# EAGLE design Hirose64-OE-Millmax-Plating (EAGLE 9.6.2)
DESIGNER: JON NEWMAN, JAKOB VOIGTS; DESIGN_NAME: HEADSTAGE-64; LICENSE: CERN OHL v1.2; REVISION: 1.2
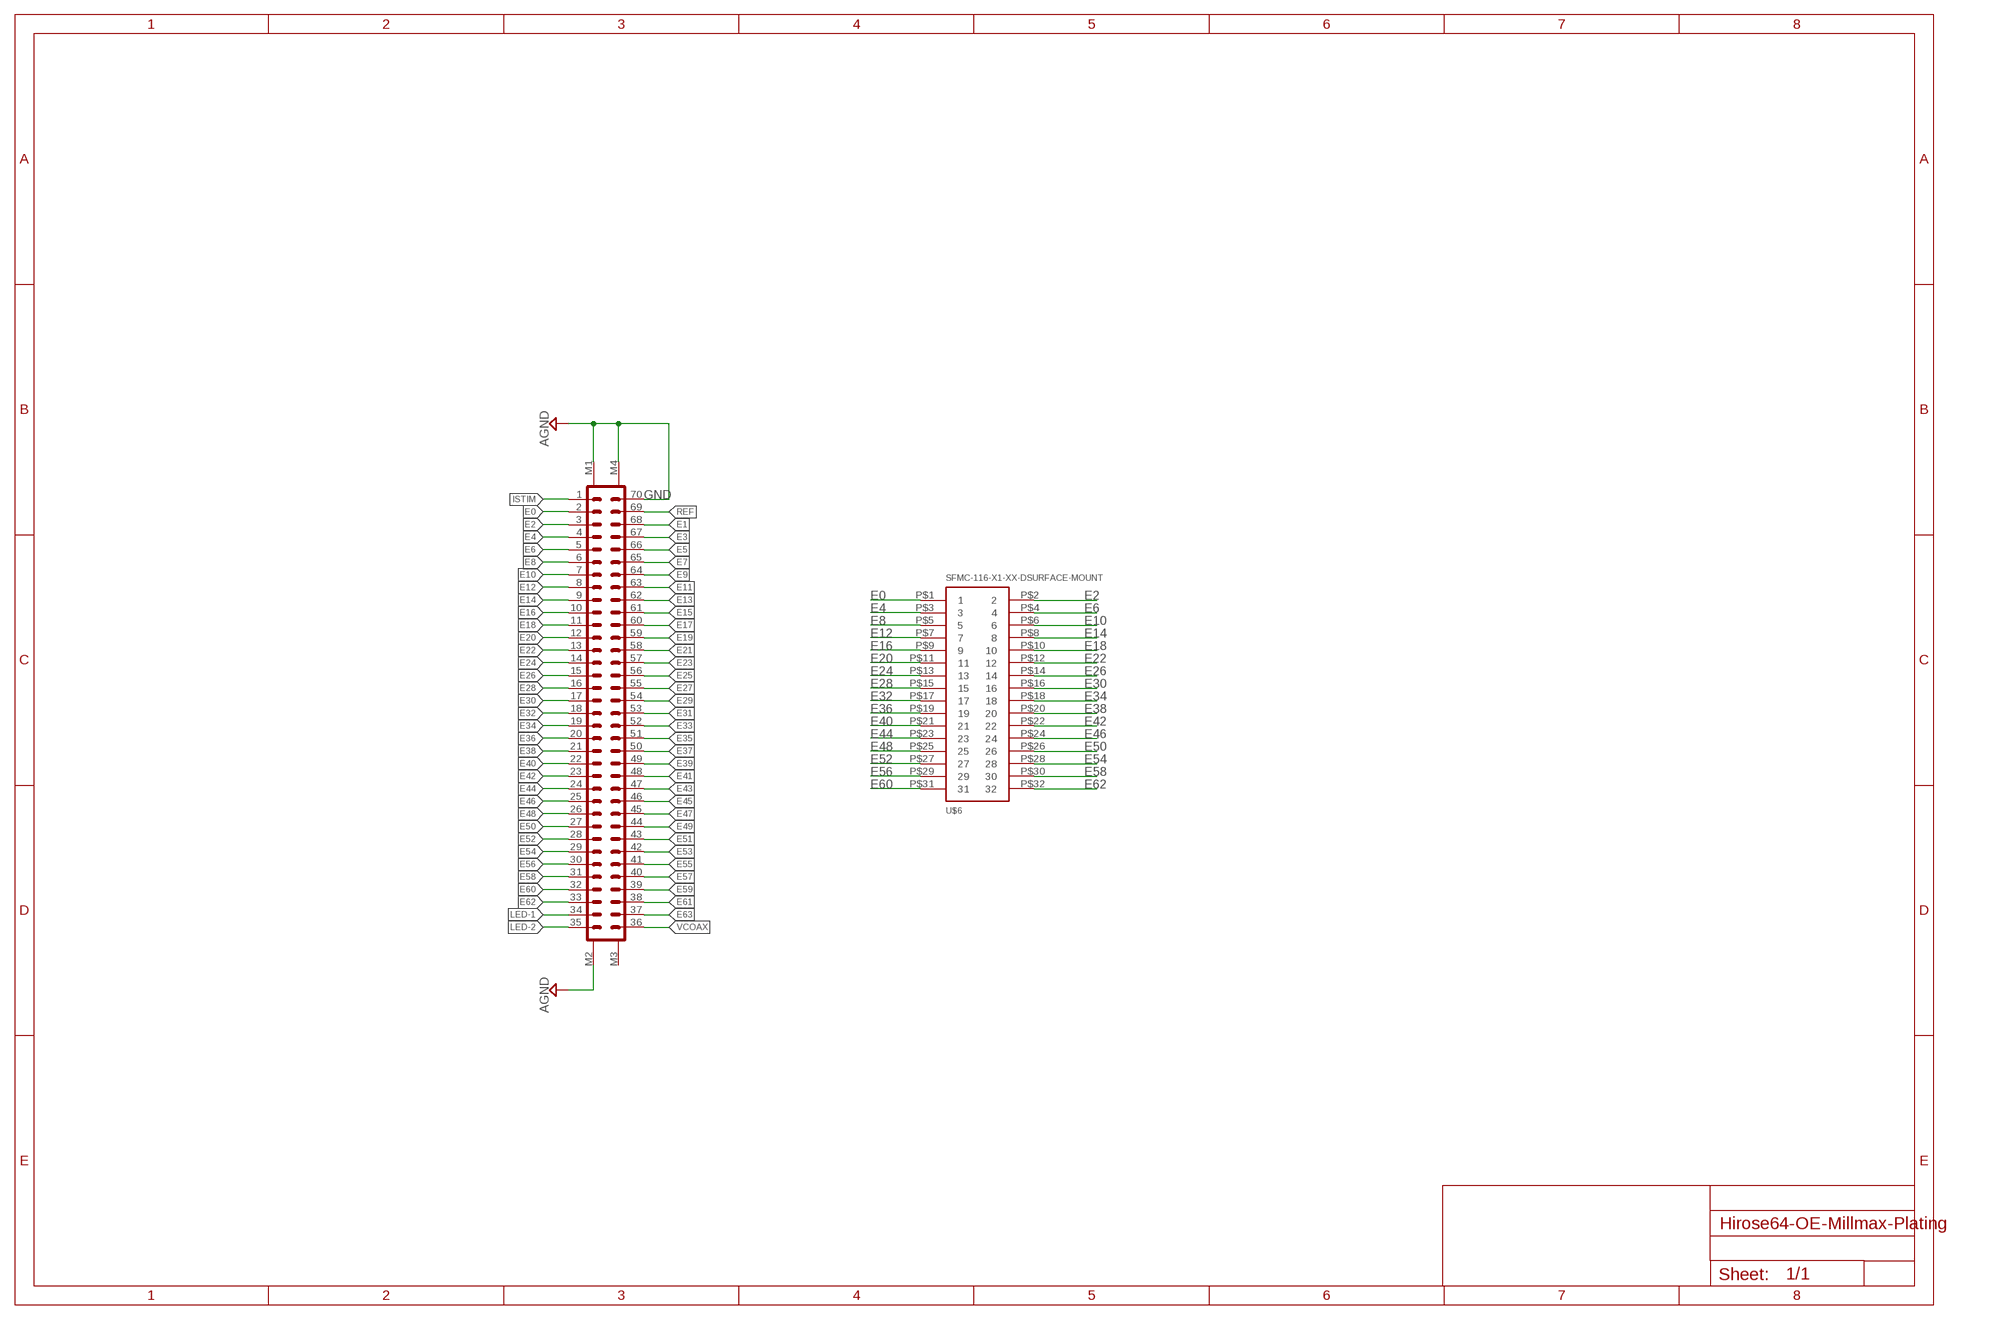
[diagram p0: schematic, sheet 1]

## Parts
J1  DF40C-70DP-0.4V(51)  PINHD-2X35+4DF40-70HEAD-LESS-SILK  [DF40-70HEAD-LESS-SILK]
U$6  SFMC-116-X1-XX-DSURFACE-MOUNT  [SFMC-116-X2-XX-D]

## Nets
E0: J1.2 U$6.P$1
E1: J1.68
E2: J1.3 U$6.P$2
E3: J1.67
E4: J1.4 U$6.P$3
E5: J1.66
E6: J1.5 U$6.P$4
E7: J1.65
E8: J1.6 U$6.P$5
E9: J1.64
E10: J1.7 U$6.P$6
E11: J1.63
E12: J1.8 U$6.P$7
E13: J1.62
E14: J1.9 U$6.P$8
E15: J1.61
E16: J1.10 U$6.P$9
E17: J1.60
E18: J1.11 U$6.P$10
E19: J1.59
E20: J1.12 U$6.P$11
E21: J1.58
E22: J1.13 U$6.P$12
E23: J1.57
E24: J1.14 U$6.P$13
E25: J1.56
E26: J1.15 U$6.P$14
E27: J1.55
E28: J1.16 U$6.P$15
E29: J1.54
E30: J1.17 U$6.P$16
E31: J1.53
E32: J1.18 U$6.P$17
E33: J1.52
E34: J1.19 U$6.P$18
E35: J1.51
E36: J1.20 U$6.P$19
E37: J1.50
E38: J1.21 U$6.P$20
E39: J1.49
E40: J1.22 U$6.P$21
E41: J1.48
E42: J1.23 U$6.P$22
E43: J1.47
E44: J1.24 U$6.P$23
E45: J1.46
E46: J1.25 U$6.P$24
E47: J1.45
E48: J1.26 U$6.P$25
E49: J1.44
E50: J1.27 U$6.P$26
E51: J1.43
E52: J1.28 U$6.P$27
E53: J1.42
E54: J1.29 U$6.P$28
E55: J1.41
E56: J1.30 U$6.P$29
E57: J1.40
E58: J1.31 U$6.P$30
E59: J1.39
E60: J1.32 U$6.P$31
E61: J1.38
E62: J1.33 U$6.P$32
E63: J1.37
GND: J1.70 J1.M1 J1.M2 J1.M4 ; supply symbol labelled AGND
ISTIM: J1.1
LED-1: J1.34
LED-2: J1.35
REF: J1.69
VCOAX: J1.36
Unconnected: J1.M3

## Library data of the parts
J1 = jonnew:PINHD-2X35+4
U$6 = UsefulConnectors:SFMC-116-X1-XX-D

## Net classes
1 thick: width 0.102 mm
2 diff: width 0.076 mm, drill 0.1 mm, clearance 0.051 mm

## Board
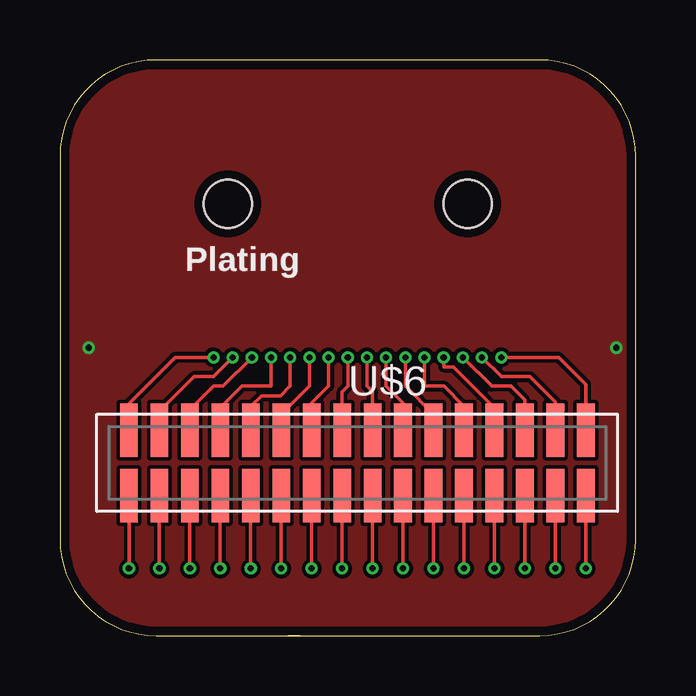
[diagram p1: board, top side]
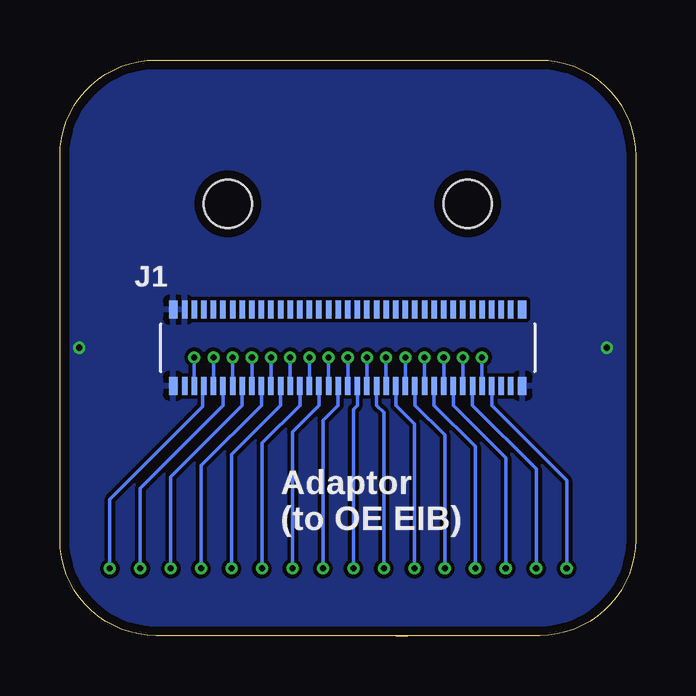
[diagram p2: board, bottom side, seen from below]

Size 24 x 24 mm. Coordinates in mm from the lower left corner, seen from the top.
Outline: 10,0 9.5,0
Outline: 0,20 0,4 arc90 4,0 20,0 arc90 24,4 24,20 arc90 20,24 4,24 arc90 0,20
Copper layers (1*16): Top 0.035559375mm / dielectric 1.6mm / Bottom 0.035559375mm
Design rules "oshpark-2layer": minimum track width 6mil, minimum drill 10mil, track to track 6mil, track to pad 6mil, pad to pad 6mil, via to via 6mil, smd to smd 6mil, copper to edge 15mil, drill to drill 6mil, minimum pad ring 5mil, minimum via ring 5mil, stop-mask expansion 2.5mil, vias tented up to drill 0mil, thermal gap 10mil
Holes 2 mm at 7,18 17,18

### Footprints (pad centres in the part's own frame; a part is rotated, then mirrored left to right if it is on the bottom)
DF40-70HEAD-LESS-SILK = smd 0.23 x 0.75: 1 -6.8,-1.585; 2 -6.4,-1.585; 3 -6,-1.585; 4 -5.6,-1.585; 5 -5.2,-1.585; 6 -4.8,-1.585; 7 -4.4,-1.585; 8 -4,-1.585; 9 -3.6,-1.585; 10 -3.2,-1.585; 11 -2.8,-1.585; 12 -2.4,-1.585; 13 -2,-1.585; 14 -1.6,-1.585; 15 -1.2,-1.585; 16 -0.8,-1.585; 17 -0.4,-1.585; 18 0,-1.585; 19 0.4,-1.585; 20 0.8,-1.585; 21 1.2,-1.585; 22 1.6,-1.585; 23 2,-1.585; 24 2.4,-1.585; 25 2.8,-1.585; 26 3.2,-1.585; 27 3.6,-1.585; 28 4,-1.585; 29 4.4,-1.585; 30 4.8,-1.585; 31 5.2,-1.585; 32 5.6,-1.585; 33 6,-1.585; 34 6.4,-1.585; 35 6.8,-1.585; 36 6.8,1.585; 37 6.4,1.585; 38 6,1.585; 39 5.6,1.585; 40 5.2,1.585; 41 4.8,1.585; 42 4.4,1.585; 43 4,1.585; 44 3.6,1.585; 45 3.2,1.585; 46 2.8,1.585; 47 2.4,1.585; 48 2,1.585; 49 1.6,1.585; 50 1.2,1.585; 51 0.8,1.585; 52 0.4,1.585; 53 0,1.585; 54 -0.4,1.585; 55 -0.8,1.585; 56 -1.2,1.585; 57 -1.6,1.585; 58 -2,1.585; 59 -2.4,1.585; 60 -2.8,1.585; 61 -3.2,1.585; 62 -3.6,1.585; 63 -4,1.585; 64 -4.4,1.585; 65 -4.8,1.585; 66 -5.2,1.585; 67 -5.6,1.585; 68 -6,1.585; 69 -6.4,1.585; 70 -6.8,1.585 | smd 0.35 x 0.75: M1 -7.275,-1.585; M2 7.275,-1.585; M3 7.275,1.585; M4 -7.275,1.585
SFMC-116-X2-XX-D = smd 0.737 x 2.223: P$1 9.525,1.365; P$2 9.525,-1.365; P$3 8.255,1.365; P$4 8.255,-1.365; P$5 6.985,1.365; P$6 6.985,-1.365; P$7 5.715,1.365; P$8 5.715,-1.365; P$9 4.445,1.365; P$10 4.445,-1.365; P$11 3.175,1.365; P$12 3.175,-1.365; P$13 1.905,1.365; P$14 1.905,-1.365; P$15 0.635,1.365; P$16 0.635,-1.365; P$17 -0.635,1.365; P$18 -0.635,-1.365; P$19 -1.905,1.365; P$20 -1.905,-1.365; P$21 -3.175,1.365; P$22 -3.175,-1.365; P$23 -4.445,1.365; P$24 -4.445,-1.365; P$25 -5.715,1.365; P$26 -5.715,-1.365; P$27 -6.985,1.365; P$28 -6.985,-1.365; P$29 -8.255,1.365; P$30 -8.255,-1.365; P$31 -9.525,1.365; P$32 -9.525,-1.365

### Placement (x,y rotation side)
J1  12,12 0 bottom
U$6  12.4,7.2 0 top

### Tracks (layer width: path | path; a pad name or v marks a point on that pad's centre or on a via)
E0  (via drill 0.25)
  Top 0.152: U$6.P$1 21.93,10.47 20.8,11.6 v18.4,11.6
  Bottom 0.152: J1.2 v18.4,11.6
E2  (via drill 0.25)
  Top 0.152: U$6.P$2 v21.93,2.8
  Bottom 0.152: J1.3 18.06,10.36 18.06,9.54 21.93,5.68 v21.93,2.8
E4  (via drill 0.25)
  Top 0.152: U$6.P$3 20.66,9.74 19.6,10.8 18.4,10.8 v17.6,11.6
  Bottom 0.152: J1.4 v17.6,11.6
E6  (via drill 0.25)
  Top 0.152: U$6.P$4 v20.66,2.8
  Bottom 0.152: J1.5 17.2,9.6 20.66,6.14 v20.66,2.8
E8  (via drill 0.25)
  Top 0.152: U$6.P$5 19.39,9.81 18.8,10.4 18,10.4 v16.8,11.6
  Bottom 0.152: J1.6 v16.8,11.6
E10  (via drill 0.25)
  Top 0.152: U$6.P$6 v19.39,2.8
  Bottom 0.152: J1.7 16.4,9.6 19.39,6.62 v19.39,2.8
E12  (via drill 0.25)
  Top 0.152: v16,11.6 16,11.2 16.4,11.2 18,9.6 18,8.68 U$6.P$7
  Bottom 0.152: J1.8 v16,11.6
E14  (via drill 0.25)
  Top 0.152: U$6.P$8 v18.11,2.8
  Bottom 0.152: J1.9 15.6,9.6 18.11,7.08 v18.11,2.8
E16  (via drill 0.25)
  Top 0.152: v15.2,11.6 J1.10 16,10.4 16.84,9.55 U$6.P$9
  Bottom 0.152: J1.10 v15.2,11.6
E18  (via drill 0.25)
  Top 0.152: U$6.P$10 v16.84,2.8
  Bottom 0.152: J1.11 14.8,9.6 16.84,7.55 v16.84,2.8
E20  (via drill 0.25)
  Top 0.152: U$6.P$11 15.57,9.22 J1.12 v14.4,11.6
  Bottom 0.152: J1.12 v14.4,11.6
E22  (via drill 0.25)
  Top 0.152: U$6.P$12 v15.57,2.8
  Bottom 0.152: J1.13 14,9.6 15.57,8.03 v15.57,2.8
E24  (via drill 0.25)
  Top 0.152: v13.6,11.6 J1.14 14.3,9.7 U$6.P$13
  Bottom 0.152: J1.14 v13.6,11.6
E26  (via drill 0.25)
  Top 0.152: U$6.P$14 v14.3,2.8
  Bottom 0.152: v14.3,2.8 14.3,8.49 13.2,9.6 J1.15
E28  (via drill 0.25)
  Top 0.152: U$6.P$15 13.04,10.16 J1.16 v12.8,11.6
  Bottom 0.152: J1.16 v12.8,11.6
E30  (via drill 0.25)
  Top 0.152: U$6.P$16 v13.04,2.8
  Bottom 0.152: J1.17 12.4,9.6 13.04,8.96 v13.04,2.8
E32  (via drill 0.25)
  Top 0.152: U$6.P$17 11.77,10.16 J1.18 v12,11.6
  Bottom 0.152: J1.18 v12,11.6
E34  (via drill 0.25)
  Top 0.152: U$6.P$18 v11.77,2.8
  Bottom 0.152: J1.19 11.6,9.6 11.77,9.44 v11.77,2.8
E36  (via drill 0.25)
  Top 0.152: v11.2,11.6 J1.20 10.49,9.7 U$6.P$19
  Bottom 0.152: J1.20 v11.2,11.6
E38  (via drill 0.25)
  Top 0.152: U$6.P$20 v10.49,2.8
  Bottom 0.152: v10.49,2.8 10.49,9.29 10.8,9.6 J1.21
E40  (via drill 0.25)
  Top 0.152: v10.4,11.6 J1.22 9.2,9.2 9.2,8.59 U$6.P$21
  Bottom 0.152: J1.22 v10.4,11.6
E42  (via drill 0.25)
  Top 0.152: U$6.P$22 v9.22,2.8
  Bottom 0.152: J1.23 10,9.6 9.22,8.82 v9.22,2.8
E44  (via drill 0.25)
  Top 0.152: v9.6,11.6 J1.24 9.2,10 8.4,10 7.96,9.55 U$6.P$23
  Bottom 0.152: J1.24 v9.6,11.6
E46  (via drill 0.25)
  Top 0.152: U$6.P$24 v7.96,2.8
  Bottom 0.152: J1.25 9.2,9.6 7.96,8.36 v7.96,2.8
E48  (via drill 0.25)
  Top 0.152: v8.8,11.6 J1.26 7.6,10.4 6.68,9.48 U$6.P$25
  Bottom 0.152: J1.26 v8.8,11.6
E50  (via drill 0.25)
  Top 0.152: U$6.P$26 v6.68,2.8
  Bottom 0.152: J1.27 8.4,9.6 6.68,7.88 v6.68,2.8
E52  (via drill 0.25)
  Top 0.152: v8,11.6 6.8,10.4 6.4,10.4 5.42,9.41 U$6.P$27
  Bottom 0.152: J1.28 v8,11.6
E54  (via drill 0.25)
  Top 0.152: U$6.P$28 v5.42,2.8
  Bottom 0.152: J1.29 7.6,9.6 5.42,7.42 v5.42,2.8
E56  (via drill 0.25)
  Top 0.152: v7.2,11.6 6.4,10.8 5.6,10.8 4.14,9.35 U$6.P$29
  Bottom 0.152: J1.30 v7.2,11.6
E58  (via drill 0.25)
  Top 0.152: U$6.P$30 v4.14,2.8
  Bottom 0.152: J1.31 6.8,9.6 4.14,6.95 v4.14,2.8
E60  (via drill 0.25)
  Top 0.152: U$6.P$31 2.88,9.68 4.8,11.6 v6.4,11.6
  Bottom 0.152: J1.32 v6.4,11.6
E62  (via drill 0.25)
  Top 0.152: U$6.P$32 v2.88,2.8
  Bottom 0.152: J1.33 6,9.6 2.88,6.47 v2.88,2.8
GND  (via drill 0.25)
  other vias: 23.2,12 1.2,12
  pour Top: 0,0 0,24 24,24 24,0
  pour Bottom: 0,0 24,0 24,24 0,24

### Text on the board
tPlace: Plating
bPlace: Adaptor / (to OE EIB)